# Altium project MB1360.PrjPcb (part 2 of 2)

## Sheet Power.SchDoc: Power
size A4; CompanyName: STMicroelectronics; Organization: Microcontrollers Division; SheetNumber: 6; SheetTotal: 8
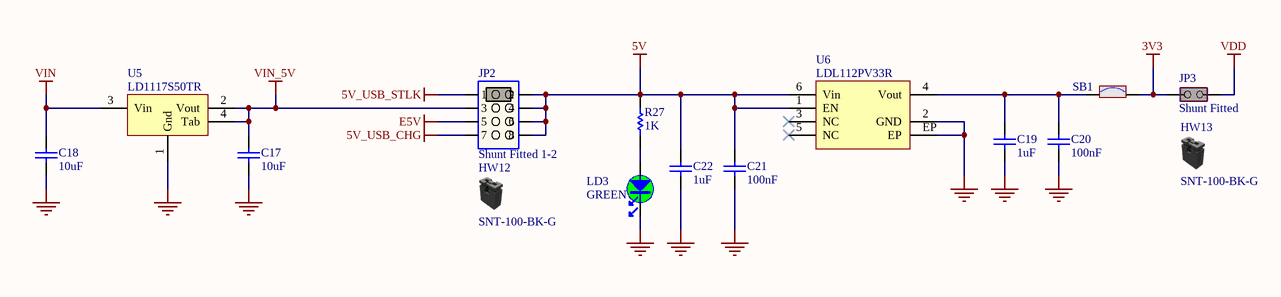
[diagram p5: Power.SchDoc]

### Parts
C17  value 10uF  [C0805]  (hidden comment: Capacitor)
C18  value 10uF  [C0805]  (hidden comment: Capacitor)
C19  value 1uF  [C0603]  (hidden comment: Capacitor)
C20  value 100nF  [C0603]  (hidden comment: Capacitor)
C21  value 100nF  [C0603]  (hidden comment: Capacitor)
C22  value 1uF  [C0603]  (hidden comment: Capacitor)
HW12  value SNT-100-BK-G  (hidden comment: Shunt Black 2.54mm)  (mechanical)
HW13  value SNT-100-BK-G  (hidden comment: Shunt Black 2.54mm)  (mechanical)
JP2  value Shunt Fitted 1-2  [CON_SAMTEC_TSW-104-07-X-D]  (hidden comment: Jumper_Header 4x2 Fitted 1-2)
JP3  value Shunt Fitted  [CON_SAMTEC_TSW-102-07-G-S]  (hidden comment: Jumper_Header 2x1 Fitted)
LD3  value GREEN  [LED_0603_GREEN]  (hidden comment: LED_green)
R27  value 1K  [R0603]  (hidden comment: Resistor)
SB1  SB_ON  [SOLDER-BRIDGE_R0603-0R]  (value not drawn)
U5  LD1117S50TR  [REG_SOT223-TAB]
U6  LDL112PV33R  [ICC_DFN6-EPAD_3X3_P095]

### Nets
3V3: JP3.2(NO) SB1.2
5V: C21.2 C22.2 JP2.2 JP2.4 JP2.6 JP2.8 R27.1 U6.1(EN) U6.6(Vin)
5V_USB_CHG: JP2.7
5V_USB_STLK: JP2.1
E5V: JP2.5
GND: C17.1 C18.1 C19.1 C20.1 C21.1 C22.1 LD3.2 U5.1(Gnd) U6.2(GND) U6.EP
VDD: JP3.1(COMMON)
VIN: C18.2 U5.3(Vin)
VIN_5V: C17.2 JP2.3 U5.2(Vout) U5.4(Tab)
NetC19_2: C19.2 C20.2 SB1.1 U6.4(Vout)
NetLD3_1: LD3.1 R27.2

Not connected (* = marked no-connect by the designer): U6 3(NC)* 5(NC)*

### Notes on the sheet
- Title:
- Project:
- Size:
- Revision:
- Variant:
- A4
- -
- Date:
- Reference:
- Sheet:
- of

### Library data of the parts
C17 C18 = MCD-00014: Capacitor, MLCC, 10uF, 25V, X5R, 10%, 0805, T=0,85mm; Manufacturer_Part_Number: CC0805KRX5R8BB106; Manufacturer: YAGEO; ECCN_US: EAR99; ECCN_EU: NEC; Provided_By: SUBCO; Internal_Part_Number: MCD-00014; ComponentLink1Description: Datasheet; Status: Released; Part_Type: Capacitor; Package: C0805; ComponentLink1URL: http://tunmcdsvn.tun.st.com/Component_Datasheet_Library/Trunk/Capacitors/Yageo_Multilayer_capacitor_X5R_series_100pF_to_100uF
C19 C22 = MCD-00010: Capacitor, MLCC, 1uF, 16V, X5R, 10%, 0603, T=0,8mm; Manufacturer_Part_Number: CC0603KRX5R7BB105; Manufacturer: YAGEO; ECCN_US: EAR99; ECCN_EU: NEC; Provided_By: SUBCO; Internal_Part_Number: MCD-00010; Status: Released; Part_Type: Capacitor; Package: C0603; ComponentLink1Description: Datasheet; ComponentLink1URL: http://tunmcdsvn.tun.st.com/Component_Datasheet_Library/Trunk/Capacitors/Yageo_Multilayer_capacitor_X5R_series_100pF_to_100uF
C20 C21 = MCD-00211: Capacitor, MLCC, 100nF, 16V, X7R, 10%, 0603, T=0,8mm; Manufacturer_Part_Number: CC0603KRX7R7BB104; Manufacturer: YAGEO; ECCN_US: EAR99; ECCN_EU: NEC; Provided_By: SUBCO; Internal_Part_Number: MCD-00211; Status: Released; Part_Type: Capacitor; Package: C0603; ComponentLink1Description: Datasheet; ComponentLink1URL: http://tunmcdsvn.tun.st.com/Component_Datasheet_Library/Trunk/Capacitors/Yageo_Multilayer_Capacitor_X7R_series_100pF_to_22uF
HW12 HW13 = MCD-00043: SHUNT 2.54mm BLACK; Manufacturer: SAMTEC; Part_Type: Mechanical; Alternate_Manufacturer_Part_Number: 316102S111A; Alternate_Manufacturer: JIUBABA; Provided_By: SUBCO; Internal_Part_Number: MCD-00043; ECCN_US: n/a; ECCN_EU: n/a; Manufacturer_Part_Number: SNT-100-BK-G; ComponentLink1Description: Datasheet; Status: Released; ComponentLink1URL: http://tunmcdsvn.tun.st.com/Component_Datasheet_Library/Trunk/Connectors/Samtec_Shunt_Jumper_SNT100
JP2 = MCD-00686: Header, 4x2, 2,54mm, VR, TH, Height 5.84mm/2.54mm - Shunt Fitted 1-2; Part_Type: Connector; Manufacturer_Part_Number: TSW-104-07-x-D; Manufacturer: SAMTEC; Provided_By: SUBCO; Internal_Part_Number: MCD-00686; Status: Released; ComponentLink1Description: Datasheet; ComponentLink1URL: http://tunmcdsvn.tun.st.com/Component_Datasheet_Library/Trunk/Connectors/Samtec_TSW-HTSW-series; ECCN_US: n/a; ECCN_EU: n/a
JP3 = MCD-00683: Header, 2x1, 2,54mm, VR, TH, Height 5.84mm/2.54mm - Shunt Fitted by default; Part_Type: Connector; Manufacturer_Part_Number: TSW-102-07-x-S; Manufacturer: SAMTEC; Alternate_Manufacturer_Part_Number: 313102S111116; Alternate_Manufacturer: LIANYI; Provided_By: SUBCO; Internal_Part_Number: MCD-00683; Status: Released; ComponentLink1Description: Datasheet; ComponentLink1URL: http://tunmcdsvn.tun.st.com/Component_Datasheet_Library/Trunk/Connectors/Samtec_TSW-HTSW-series; ECCN_US: n/a; ECCN_EU: n/a
LD3 = MCD-00050: LED, Green, 0603; Part_Type: Display; Manufacturer_Part_Number: 19-213SYGC/S530-E2/TR8; Manufacturer: EVERLIGHT; ECCN_US: EAR99; ECCN_EU: NEC; Provided_By: SUBCO; Internal_Part_Number: MCD-00050; Status: Released; ComponentLink1Description: Datasheet; ComponentLink1URL: http://tunmcdsvn.tun.st.com/Component_Datasheet_Library/Trunk/Display/Everlight_SMD-LED-GREEN_19-213SYGC-S530-XX-TR8-v3.doc; Package: LED 0603
R27 = MCD-00070: Resistor,1K,0603,1%,1/10W; Manufacturer_Part_Number: RC0603FR-071KL; Manufacturer: YAGEO; ECCN_US: EAR99; ECCN_EU: NEC; Provided_By: SUBCO; Internal_Part_Number: MCD-00070; Status: Released; Part_Type: Resistor; Package: R0603; ComponentLink1Description: Datasheet; ComponentLink1URL: http://tunmcdsvn.tun.st.com/Component_Datasheet_Library/Trunk/Resistors/Yageo_Resistor_RC0603-series
SB1 = MCD-00071: Solder Bridge ON; Part_Type: Mechanical; Manufacturer_Part_Number: RC0603JR-070RL; Manufacturer: YAGEO; Provided_By: SUBCO; Internal_Part_Number: MCD-00071; ECCN_US: n/a; ECCN_EU: n/a; Status: Released; Package: SB0603; ComponentLink1Description: Datasheet; ComponentLink1URL: http://tunmcdsvn.tun.st.com/Component_Datasheet_Library/Trunk/Resistors/Yageo_Resistor_RC0603-series
U5 = MCD-00088: IC REG LDO 5V 0.8A SOT223; Manufacturer: STMICROELECTRONICS; BMS_Part_Number: 9176133; ECCN_US: EAR99; ECCN_EU: NEC; Provided_By: SUBCO with ST control; Internal_Part_Number: MCD-00088; Value: LD1117S50TR; Status: Released; Part_Type: IC; Manufacturer_Part_Number: LD1117S50TR; ComponentLink1Description: Datasheet; ComponentLink1URL: http://tunmcdsvn.tun.st.com/Component_Datasheet_Library/Trunk/IC/STM_LDO_LD1117; Package: SOT-223
U6 = MCD-00664: 1.2 A low quiescent current LDO with reverse current protection; Part_Type: IC; Manufacturer: STMICROELECTRONICS; BMS_Part_Number: 9176253; ECCN_US: EAR99; ECCN_EU: NEC; Provided_By: SUBCO with ST control; Internal_Part_Number: MCD-00664; Value: LDL112PV33R; Status: Released; Manufacturer_Part_Number: LDL112PV33R; Package: DFN6; ComponentLink1Description: Datasheet; ComponentLink1URL: http://tunmcdsvn.tun.st.com/Component_Datasheet_Library/Trunk/IC/STM_LDO_LDL112PV33R

## Sheet STM32_microcontroller_power.SchDoc: STM32_microcontroller_power
size A4; SheetNumber: 4; SheetTotal: 8
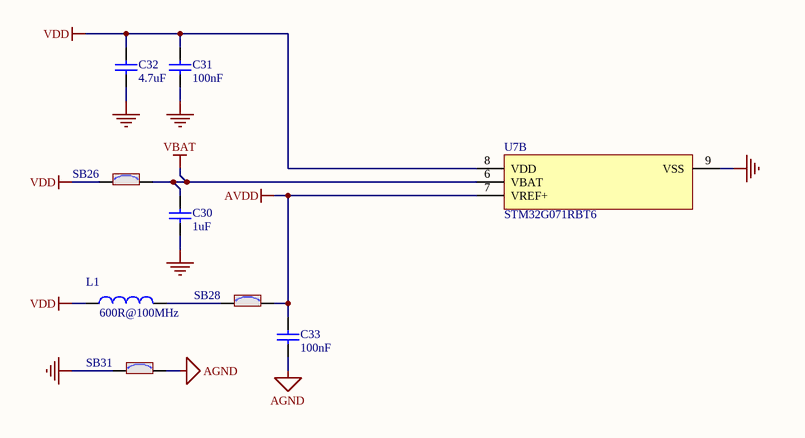
[diagram p6: STM32_microcontroller_power.SchDoc]

### Parts
C30  value 1uF  [C0603]  (hidden comment: Capacitor)
C31  value 100nF  [C0603]  (hidden comment: Capacitor)
C32  value 4.7uF  [C0603]  (hidden comment: Capacitor)
C33  value 100nF  [C0603]  (hidden comment: Capacitor)
L1  value 600R@100MHz  [L0603]  (hidden comment: BEAD)
SB26  SB_ON  [SOLDER-BRIDGE_R0603-0R]  (value not drawn)
SB28  SB_ON  [SOLDER-BRIDGE_R0603-0R]  (value not drawn)
SB31  SB_ON  [SOLDER-BRIDGE_R0603-0R]  (value not drawn)
U7  STM32G071RBT6  [ICC_LQFP64_10X10_P050_SOCKET_YAMAICHI_IC149-064-069-B5]  (part B of 2)

### Nets
AGND: C33.1 SB31.2
AVDD: C33.2 SB28.2 U7.7(VREF+)
GND: C30.1 C31.1 C32.1 SB31.1 U7.9(VSS)
VBAT: C30.2 SB26.2 U7.6(VBAT)
VDD: C31.2 C32.2 L1.1 SB26.1 U7.8(VDD)
NetL1_2: L1.2 SB28.1

### Notes on the sheet
- Title:
- Project:
- Size:
- Revision:
- Variant:
- A4
- -
- Date:
- Reference:
- Sheet:
- of

### Library data of the parts
C30 = MCD-00010: as C19 on sheet Power; Internal_Part_Number: MCD-00010; Status: Released; Part_Type: Capacitor; Package: C0603; ComponentLink1Description: Datasheet; ComponentLink1URL: http://tunmcdsvn.tun.st.com/Component_Datasheet_Library/Trunk/Capacitors/Yageo_Multilayer_capacitor_X5R_series_100pF_to_100uF
C31 C33 = MCD-00211: as C20 on sheet Power; Internal_Part_Number: MCD-00211; Status: Released; Part_Type: Capacitor; Package: C0603; ComponentLink1Description: Datasheet; ComponentLink1URL: http://tunmcdsvn.tun.st.com/Component_Datasheet_Library/Trunk/Capacitors/Yageo_Multilayer_Capacitor_X7R_series_100pF_to_22uF
C32 = MCD-00009: Capacitor, MLCC, 4.7uF, 16V, X5R, 10%, 0603, T=0.8mm; Manufacturer_Part_Number: CC0603KRX5R7BB475; Manufacturer: YAGEO; ECCN_US: EAR99; ECCN_EU: NEC; Provided_By: SUBCO; Internal_Part_Number: MCD-00009; Status: Released; Part_Type: Capacitor; Package: C0603; ComponentLink1Description: Datasheet; ComponentLink1URL: http://tunmcdsvn.tun.st.com/Component_Datasheet_Library/Trunk/Capacitors/Yageo_Multilayer_capacitor_X5R_series_100pF_to_100uF
L1 = MCD-00047: SMD Chip ferrite bead, 600R@100MHz +/-25%, 350mA, 500mohm DC, 0603, T=0.8mm; Manufacturer_Part_Number: FCM1608KF-601T03; Manufacturer: TAI-TECH; Part_Type: Inductor; Provided_By: SUBCO; Internal_Part_Number: MCD-00047; ECCN_US: n/a; ECCN_EU: n/a; ComponentLink1Description: Datasheet; Status: Released; ComponentLink1URL: http://tunmcdsvn.tun.st.com/Component_Datasheet_Library/Trunk/Inductors/TaiTech_Bead_FCM1608_series
SB26 SB28 SB31 = MCD-00071: as SB1 on sheet Power; Internal_Part_Number: MCD-00071; ECCN_US: n/a; ECCN_EU: n/a; Status: Released; Package: SB0603; ComponentLink1Description: Datasheet; ComponentLink1URL: http://tunmcdsvn.tun.st.com/Component_Datasheet_Library/Trunk/Resistors/Yageo_Resistor_RC0603-series
U7 = MCD-00662: Medium-density performance line ARM-based 32-bit MCU with 128KB Flash. LQFP64 IC149-064-069-B5 socket footprint.; Part_Type: IC; Manufacturer: STMICROELECTRONICS; BMS_Part_Number: 9175318; ECCN_US: 3A991A2; ECCN_EU: NEC; Provided_By: SUBCO with ST control; Internal_Part_Number: MCD-00662; Value: STM32G071RBT6; Status: Checked; Manufacturer_Part_Number: STM32G071RBT6; Package: LQFP64 IC149-064-069-B5 socket; ComponentLink1Description: Datasheet; ComponentLink1URL: http://tunmcdsvn.tun.st.com/Component_Datasheet_Library/Trunk/IC/STM_POA_ LQFP 10x10 64L

## Sheet HW_Mechanical_Parts.SchDoc: HW Mechanical parts
size A4; SheetNumber: 8; SheetTotal: 8
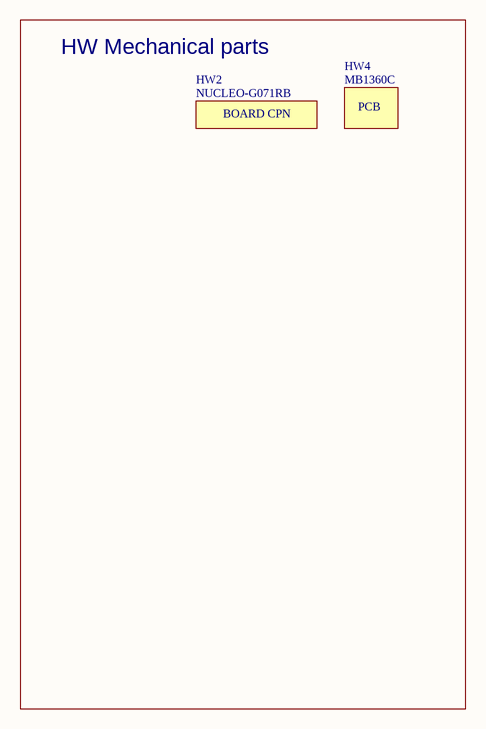
[diagram p7: HW_Mechanical_Parts.SchDoc]

### Parts
HW2  value NUCLEO-G071RB  (hidden comment: STICKER_BOARD_CPN)  (mechanical)
HW4  value MB1360C  (hidden comment: PCB)  (mechanical)

### Blocks framed on the sheet
HW Mechanical parts: HW2 HW4

### Notes on the sheet
- Title:
- Project:
- Size:
- Revision:
- Variant:
- A4
- -
- Date:
- Reference:
- Sheet:
- of
- (in symbol MCD-00549) BOARD CPN

### Library data of the parts
HW2 = MCD-00549: Sticker to mention board CPN code; Part_Type: Mechanical; Provided_By: Subcon; Initial_Board_Reference: mb1319; Internal_Part_Number: MCD-00549; ECCN_US: n/a; ECCN_EU: n/a; Status: Released
HW4 = MCD-00216: PCB, xxxx for PCB number, Y for PCB revision; Part_Type: Mechanical; Provided_By: SUBCO; Internal_Part_Number: MCD-00216; Status: Released; ECCN_US: n/a; ECCN_EU: n/a; Manufacturer_Part_Number: n/a; Manufacturer: n/a; ComponentLink1Description: Datasheet

## Nets that join several sheets
3V3: ST_LINK_V2-1 (R22.1), Arduino_extension_connectors (5 pins), Power (JP3.2 SB1.2)
5V: ST_LINK_V2-1 (D2.1), Arduino_extension_connectors (CN7.18 J1.5), Power (9 pins)
5V_USB_CHG: ST_LINK_V2-1 (10 pins), Arduino_extension_connectors (CN10.8), Power (JP2.7)
5V_USB_STLK: ST_LINK_V2-1 (C9.2 U4.1), Power (JP2.1)
AGND: Arduino_extension_connectors (C29.1 CN10.9 CN10.32 J1.29), STM32_microcontroller_power (C33.1 SB31.2)
AVDD: Arduino_extension_connectors (C29.2 SB21.2), STM32_microcontroller_power (C33.2 SB28.2 U7.7)
E5V: ST_LINK_V2-1 (D5.1), Arduino_extension_connectors (CN7.6), Power (JP2.5)
GND: ST_LINK_V2-1 (47 pins), Arduino_extension_connectors (9 pins), STM32_microcontroller_IOs (11 pins), Power (10 pins), STM32_microcontroller_power (5 pins)
VBAT: Arduino_extension_connectors (CN7.33), STM32_microcontroller_power (C30.2 SB26.2 U7.6)
VDD: Arduino_extension_connectors (CN7.5), STM32_microcontroller_IOs (R29.2 SB29.2), Power (JP3.1), STM32_microcontroller_power (5 pins)
VIN: Arduino_extension_connectors (CN7.24 J1.8), Power (C18.2 U5.3)
VIN_5V: ST_LINK_V2-1 (D4.1), Power (C17.2 JP2.3 U5.2 U5.4)
MCO: ST_LINK_V2-1 (SB17.2), Arduino_extension_connectors (SB25.1), STM32_microcontroller_IOs (R33.1 U7.10)
NRST: ST_LINK_V2-1 (SB19.2), Arduino_extension_connectors (CN7.14 J1.3), STM32_microcontroller_IOs (B2.3 B2.4 C28.2 U7.12)
PA0: Arduino_extension_connectors (CN7.28 J1.9), STM32_microcontroller_IOs (U7.17)
PA1: Arduino_extension_connectors (CN7.30 J1.10), STM32_microcontroller_IOs (U7.18)
PA2: Arduino_extension_connectors (CN10.34), STM32_microcontroller_IOs (U7.19)
PA3: Arduino_extension_connectors (CN10.6), STM32_microcontroller_IOs (U7.20)
PA4: Arduino_extension_connectors (CN7.32 J1.11), STM32_microcontroller_IOs (U7.21)
PA5: Arduino_extension_connectors (CN10.11 J1.28 SB22.2), STM32_microcontroller_IOs (U7.22)
PA6: Arduino_extension_connectors (CN10.13 J1.27), STM32_microcontroller_IOs (U7.23)
PA7: Arduino_extension_connectors (CN10.15 J1.26), STM32_microcontroller_IOs (U7.24)
PA8: Arduino_extension_connectors (CN10.23 J1.22), STM32_microcontroller_IOs (U7.36)
PA9: Arduino_extension_connectors (CN10.21 J1.23), STM32_microcontroller_IOs (U7.37)
PA10: Arduino_extension_connectors (CN10.33 J1.17), STM32_microcontroller_IOs (U7.42)
PA11: Arduino_extension_connectors (CN10.14), STM32_microcontroller_IOs (U7.43)
PA12: Arduino_extension_connectors (CN10.12), STM32_microcontroller_IOs (U7.44)
PA13: ST_LINK_V2-1 (SB13.1), Arduino_extension_connectors (CN7.13), STM32_microcontroller_IOs (U7.45)
PA14: ST_LINK_V2-1 (SB9.1), Arduino_extension_connectors (CN7.7), STM32_microcontroller_IOs (U7.46)
PA15: Arduino_extension_connectors (CN7.17), STM32_microcontroller_IOs (U7.47)
PB0: Arduino_extension_connectors (CN10.17 J1.25), STM32_microcontroller_IOs (U7.27)
PB1: Arduino_extension_connectors (CN7.34 J1.12), STM32_microcontroller_IOs (U7.28)
PB2: Arduino_extension_connectors (CN10.22), STM32_microcontroller_IOs (U7.29)
PB3: Arduino_extension_connectors (CN10.31 J1.18), STM32_microcontroller_IOs (U7.57)
PB4: Arduino_extension_connectors (CN10.27 J1.20), STM32_microcontroller_IOs (U7.58)
PB5: Arduino_extension_connectors (CN10.29 J1.19), STM32_microcontroller_IOs (U7.59)
PB6: Arduino_extension_connectors (CN10.24), STM32_microcontroller_IOs (U7.60)
PB7: Arduino_extension_connectors (CN7.21), STM32_microcontroller_IOs (U7.61)
PB8: Arduino_extension_connectors (CN10.3 J1.32 SB5.2), STM32_microcontroller_IOs (U7.62)
PB9: Arduino_extension_connectors (CN10.5 J1.31 SB2.2), STM32_microcontroller_IOs (U7.63)
PB10: Arduino_extension_connectors (CN10.28), STM32_microcontroller_IOs (U7.30)
PB11: Arduino_extension_connectors (SB4.1), STM32_microcontroller_IOs (U7.31)
PB12: Arduino_extension_connectors (SB3.1), STM32_microcontroller_IOs (U7.32)
PB13: Arduino_extension_connectors (CN10.30), STM32_microcontroller_IOs (U7.33)
PB14: Arduino_extension_connectors (CN10.25 J1.21), STM32_microcontroller_IOs (U7.34)
PB15: Arduino_extension_connectors (CN10.26), STM32_microcontroller_IOs (U7.35)
PC0: Arduino_extension_connectors (CN10.18), STM32_microcontroller_IOs (U7.13)
PC1: Arduino_extension_connectors (CN10.16), STM32_microcontroller_IOs (U7.14)
PC2: Arduino_extension_connectors (CN7.35), STM32_microcontroller_IOs (U7.15)
PC3: Arduino_extension_connectors (CN7.37), STM32_microcontroller_IOs (U7.16)
PC4: Arduino_extension_connectors (CN10.35 J1.16), STM32_microcontroller_IOs (U7.25)
PC5: Arduino_extension_connectors (CN10.37 J1.15), STM32_microcontroller_IOs (U7.26)
PC6: Arduino_extension_connectors (CN10.4), STM32_microcontroller_IOs (U7.38)
PC7: Arduino_extension_connectors (CN10.19 J1.24), STM32_microcontroller_IOs (U7.39)
PC8: Arduino_extension_connectors (CN10.2), STM32_microcontroller_IOs (U7.48)
PC9: Arduino_extension_connectors (CN10.1), STM32_microcontroller_IOs (U7.49)
PC10: Arduino_extension_connectors (CN7.1), STM32_microcontroller_IOs (U7.64)
PC11: Arduino_extension_connectors (CN7.2), STM32_microcontroller_IOs (U7.1)
PC12: Arduino_extension_connectors (CN7.3), STM32_microcontroller_IOs (U7.2)
PC13: Arduino_extension_connectors (CN7.23), STM32_microcontroller_IOs (SB20.1 U7.3)
PC14: Arduino_extension_connectors (SB23.1), STM32_microcontroller_IOs (R31.1 U7.4)
PC15: Arduino_extension_connectors (SB24.1), STM32_microcontroller_IOs (R32.1 U7.5)
PD0: Arduino_extension_connectors (CN7.9), STM32_microcontroller_IOs (U7.50)
PD1: Arduino_extension_connectors (CN7.10), STM32_microcontroller_IOs (U7.51)
PD2: Arduino_extension_connectors (CN7.4), STM32_microcontroller_IOs (U7.52)
PD3: Arduino_extension_connectors (CN7.11), STM32_microcontroller_IOs (U7.53)
PD4: Arduino_extension_connectors (CN7.15), STM32_microcontroller_IOs (U7.54)
PD5: Arduino_extension_connectors (CN7.26), STM32_microcontroller_IOs (U7.55)
PD6: Arduino_extension_connectors (CN10.10), STM32_microcontroller_IOs (U7.56)
PD8: Arduino_extension_connectors (CN10.36), STM32_microcontroller_IOs (SB30.1 U7.40)
PD9: Arduino_extension_connectors (CN10.38), STM32_microcontroller_IOs (SB29.1 U7.41)
PF1: Arduino_extension_connectors (SB27.1), STM32_microcontroller_IOs (R34.1 U7.11)

## Assembly variants
MB1360-B01: not fitted C11 C25 C26 C29 HW3 R2 R3 R33 R34 X3
G071RB: not fitted C11 C25 C26 C29 HW3 R2 R3 R33 R34 X3
G070RB: not fitted C11 C25 C26 C29 HW3 R2 R3 R33 R34 X3
G0B1RE: not fitted C11 C25 C26 C29 HW3 R2 R3 R33 R34 X3
G071RB_S: not fitted C11 C25 C26 C29 R2 R3 R33 R34 X3